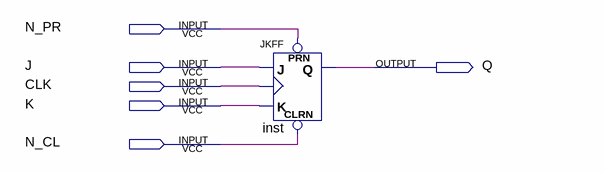
[diagram p0: schematic sheet]
// Quartus schematic top.bdf as structural Verilog: 1 symbols, 6 pins
module top (
  input  N_PR,
  input  J,
  input  CLK,
  input  K,
  input  N_CL,
  output Q
);

  JKFF inst (.PRN(N_PR), .CLRN(N_CL), .K(K), .J(J), .CLK(CLK), .Q(Q));
endmodule
